# EAGLE schematic driver ckt_component (EAGLE 7.7.0)
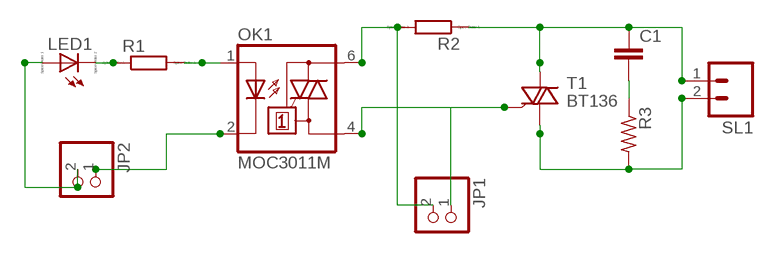
[diagram p0: schematic, sheet 1]

## Parts
C1  C5/2.5  [C5B2.5]
JP1  PINHD-1X2  [1X02]
JP2  PINHD-1X2  [1X02]
LED1  LED_E  [LED_1206]
OK1  MOC3011M  [DIL06]
R1  R0204/7  [0204/7]
R2  R0204/7  [0204/7]
R3  R-US_0411/15  [0411/15]
SL1  M02  [02P]
T1  BT136  [TO220AB]

## Nets
N$1: JP1.2 OK1.6(A2) R2.2
N$2: C1.1 R2.1 SL1.1 T1.2(A2)
N$3: JP1.1 OK1.4(A1) T1.3(G)
N$4: R3.2 SL1.2 T1.1(A1)
N$5: C1.2 R3.1
N$7: LED1.C R1.1
N$8: OK1.1(A) R1.2
N$9: JP2.2 LED1.A
N$10: JP2.1 OK1.2(C)

## Library data of the parts
C1 = capacitor-wima:C: CAPACITOR naming: grid - package width
JP1 JP2 = pinhead:PINHD-1X2: PIN HEADER
LED1 = eagle-ltspice:LED_E: LED Source: http://www.osram.convergy.de Source: www.luxeon.com Source: www.kingbright.com; SPICEMODEL: NONE; SPICEPREFIX: D; SPICETYPE: diode
OK1 = optocoupler:MOC30*M: RANDOM-PHASE OPTOISOLATORS TRIAC DRIVER OUTPUT Source: http://www.fairchildsemi.com MOC3020-M.pdf; MF: FAIRCHILD SEMICONDUCTOR; MPN: MOC3011-M; OC_FARNELL: 1021363; OC_NEWARK: 72K8893
R1 R2 = eagle-ltspice:R: RESISTOR, European symbol; SPICEMODEL: NONE; SPICEPREFIX: R
R3 = resistor:R-US_: RESISTOR, American symbol
SL1 = con-amp-quick:M02: AMP QUICK CONNECTOR; OC_FARNELL: unknown; OC_NEWARK: unknown
T1 = triac:BT136: Triac BT136 series E sensitive gate Source: http://www.nxp.com/acrobat_download/datasheets/BT136_SERIES_E_2.pdf